# EAGLE design nevjegykartya2019 (EAGLE 9.4.2)
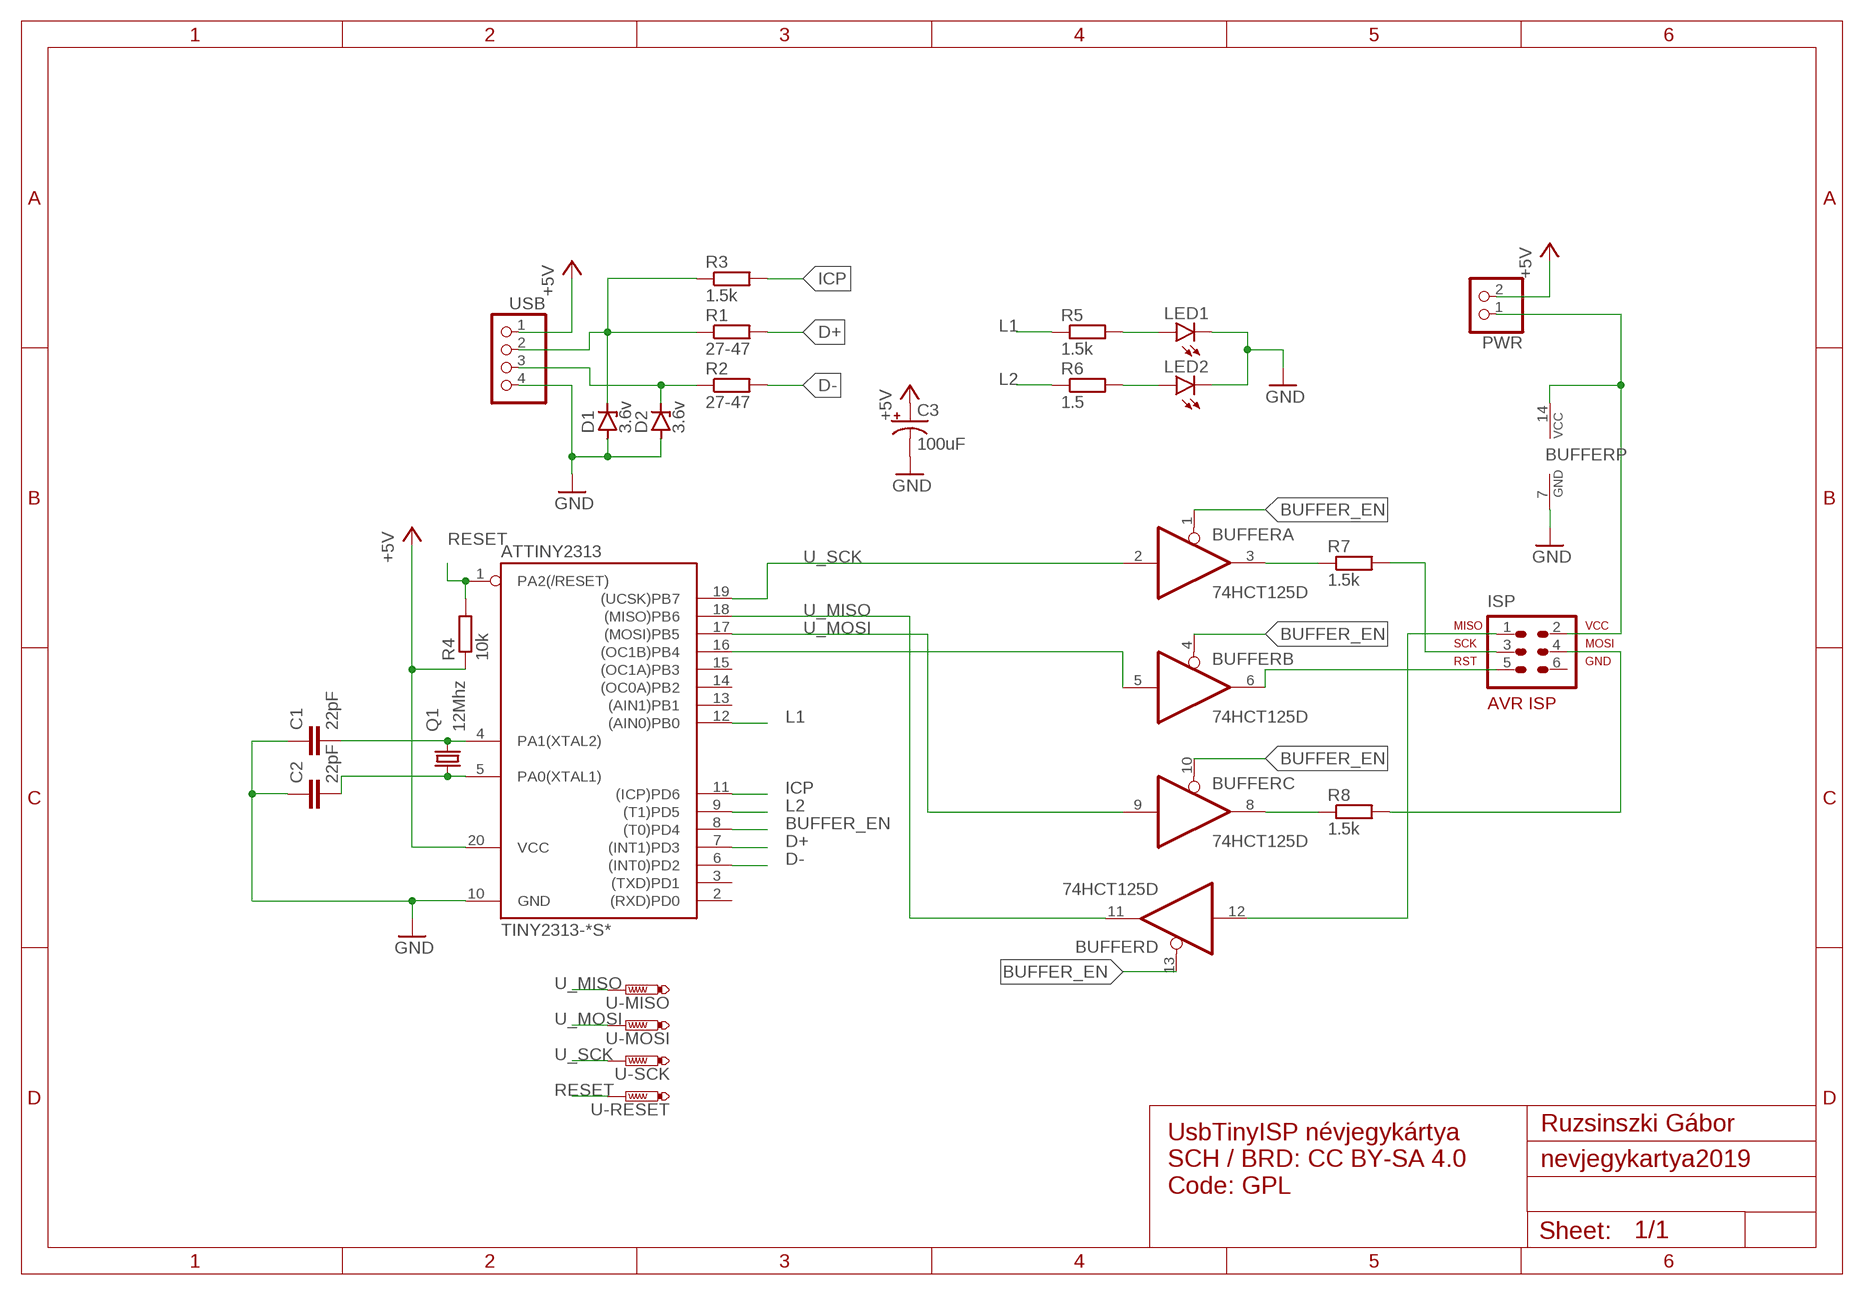
[diagram p0: schematic, sheet 1]

## Parts
ATTINY2313  TINY2313-*S*  [SO20L$]
BUFFER  74HCT125D  [SO14]
C1  22pF  C-EUC1206  [C1206]
C2  22pF  C-EUC1206  [C1206]
C3  100uF  CPOL-USE2.5-5  [E2,5-5]
D1  3.6v  ZENER-DIODESOT223  [SOT223]
D2  3.6v  ZENER-DIODESOT223  [SOT223]
ISP  AVR-ISP-6VERT  [AVR-ISP-6]
LED1  LEDCHIPLED_1206  [CHIPLED_1206]
LED2  LEDCHIPLED_1206  [CHIPLED_1206]
PWR  PINHD-1X2/90  [1X02/90]
Q1  12Mhz  KX-12B  [6.0X3.5_2]
R1  27-47  R-EU_M1206  [M1206]
R2  27-47  R-EU_M1206  [M1206]
R3  1.5k  R-EU_M1206  [M1206]
R4  10k  R-EU_M1206  [M1206]
R5  1.5k  R-EU_M1206  [M1206]
R6  1.5  R-EU_M1206  [M1206]
R7  1.5k  R-EU_M1206  [M1206]
R8  1.5k  R-EU_M1206  [M1206]
U-MISO  PTR1TP20SQ  [TP20SQ]
U-MOSI  PTR1TP20SQ  [TP20SQ]
U-RESET  PTR1TP20SQ  [TP20SQ]
U-SCK  PTR1TP20SQ  [TP20SQ]
USB  PINHD-1X4/90  [1X04/90]

## Nets
+5V: ATTINY2313.20(VCC) C3.+ PWR.2 R4.1 USB.1
BUFFER_EN: ATTINY2313.8((T0)PD4) BUFFER.1(A:OE) BUFFER.4(B:OE) BUFFER.10(C:OE) BUFFER.13(D:OE)
D+: ATTINY2313.7((INT1)PD3) R1.2
D-: ATTINY2313.6((INT0)PD2) R2.2
GND: ATTINY2313.10(GND) BUFFER.7(P:GND) C1.1 C2.1 C3.- D1.1(A) D2.1(A) LED1.C LED2.C USB.4
ICP: ATTINY2313.11((ICP)PD6) R3.2
L1: ATTINY2313.12((AIN0)PB0) R5.1
L2: ATTINY2313.9((T1)PD5) R6.1
MISO: BUFFER.12(D:I) ISP.1
MOSI: ISP.4 R8.2
N$1: LED2.A R6.2
N$2: D1.4(C) R1.1 R3.1 USB.2
N$3: D2.4(C) R2.1 USB.3
N$5: LED1.A R5.2
N$6: BUFFER.8(C:O) R8.1
N$7: BUFFER.3(A:O) R7.1
N$13: ATTINY2313.16((OC1B)PB4) BUFFER.5(B:I)
N$16: ATTINY2313.4(PA1(XTAL2)) C1.2 Q1.2
N$17: BUFFER.14(P:VCC) ISP.2 PWR.1
N$18: ATTINY2313.5(PA0(XTAL1)) C2.2 Q1.1
RESET: ATTINY2313.1(PA2(/RESET)) R4.2 U-RESET.TP
RST: BUFFER.6(B:O) ISP.5
SCK: ISP.3 R7.2
U_MISO: ATTINY2313.18((MISO)PB6) BUFFER.11(D:O) U-MISO.TP
U_MOSI: ATTINY2313.17((MOSI)PB5) BUFFER.9(C:I) U-MOSI.TP
U_SCK: ATTINY2313.19((UCSK)PB7) BUFFER.2(A:I) U-SCK.TP
Unconnected: ATTINY2313.2((RXD)PD0) ATTINY2313.3((TXD)PD1) ATTINY2313.13((AIN1)PB1) ATTINY2313.14((OC0A)PB2) ATTINY2313.15((OC1A)PB3) ISP.6

## Notes on the sheet
- Ruzsinszki Gábor
- UsbTinyISP névjegykártya
  SCH / BRD: CC BY-SA 4.0
  Code: GPL

## Library data of the parts
ATTINY2313 = avr:TINY2313*: Atmel Tiny2313 2K Flash, 128 bytes EEPROM, 128 bytes RAM
BUFFER = 74xx-eu:74*125: Quad bus BUFFER, 3-state
C1 C2 = rcl:C-EU: CAPACITOR, European symbol; SPICEPREFIX: C
C3 = rcl-ez:CPOL-US: POLARIZED CAPACITOR, American symbol
D1 D2 = diode:ZENER-DIODE: Z-Diode
ISP = avr:AVR-ISP-6: AVR ISP-6 Serial Programming Header
LED1 LED2 = led:LED: LED OSRAM: - CHIPLED LG R971, LG N971, LY N971, LG Q971, LY Q971, LO R971, LY R971 LH N974, LH R974 LS Q976, LO Q976, LY Q976 LO Q996 - Hyper CHIPLED LW Q18S LB Q993, LB Q99A, LB R99A - SideLED LS A670, LO A670, LY A670, LG A670, LP A670 LB A673, LV A673, LT A673, LW A673 LH A674 LY A675 LS A676, LA A676, LO A676, LY A676, LW A676 LS A679, LY A679, LG A679 - Hyper Micro SIDELED® LS Y876, LA Y876, LO Y876, LY Y876 LT Y87S - SmartLED LW L88C, LW L88S LB L89C, LB L89S, LG L890 LS L89K, LO L89K, LY L89K LS L896, LA L896, LO L896, LY L896 - TOPLED LS T670, LO T670, LY T670, LG T670, LP T670 LSG T670, LSP T670, LSY T670, LOP T670, LYG T670 LG T671, LOG T671, LSG T671 LB T673, LV T673, LT T673, LW T673 LH T674 LS T676, LA T676, LO T676, LY T676, LB T676, LH T676, LSB T676, LW T676 LB T67C, LV T67C, LT T67C, LS T67K, LO T67K, LY T67K, LW E67C LS E67B, LA E67B, LO E67B, LY E67B, LB E67C, LV E67C, LT E67C LW T67C LS T679, LY T679, LG T679 LS T770, LO T770, LY T770, LG T770, LP T770 LB T773, LV T773, LT T773, LW T773 LH T774 LS E675, LA E675, LY E675, LS T675 LS T776, LA T776, LO T776, LY T776, LB T776 LHGB T686 LT T68C, LB T68C - Hyper Mini TOPLED® LB M676 - Mini TOPLED Santana® LG M470 LS M47K, LO M47K, LY M47K Source: http://www.osram.convergy.de LUXEON: - LUMILED® LXK2-PW12-R00, LXK2-PW12-S00, LXK2-PW14-U00, LXK2-PW14-V00 LXK2-PM12-R00, LXK2-PM12-S00, LXK2-PM14-U00 LXK2-PE12-Q00, LXK2-PE12-R00, LXK2-PE12-S00, LXK2-PE14-T00, LXK2-PE14-U00 LXK2-PB12-K00, LXK2-PB12-L00, LXK2-PB12-M00, LXK2-PB14-N00, LXK2-PB14-P00, LXK2-PB14-Q00 LXK2-PR12-L00, LXK2-PR12-M00, LXK2-PR14-Q00, LXK2-PR14-R00 LXK2-PD12-Q00, LXK2-PD12-R00, LXK2-PD12-S00 LXK2-PH12-R00, LXK2-PH12-S00 LXK2-PL12-P00, LXK2-PL12-Q00, LXK2-PL12-R00 Source: www.luxeon.com KINGBRIGHT: KA-3528ASYC Source: www.kingbright.com
PWR = pinhead:PINHD-1X2: PIN HEADER
Q1 = crystal-geyer_V1_0:KX: Quartz Crystals (MHz) SMD: KX - Serie Model Size l/w/h [mm] Frequency Range Frequency Stability Temp. Range [°C] Load Capacitance AECQ 200 availabel Datasheet KX-4 KX-5 KX-6 KX-7 KX-9A KX-9B KX-12A KX-12B KX-13 KX-20 KX-K KX-KS 1.6/1.2/0.3 2.0/1.6/0.45 2.5/2.0/0.55 3.2/2.5/0.8 5.0/3.2/1.0 5.0/3.2/1.1 6.0/3.5/1.1 6.0/3.5/1.0 7.0/5.0 /1.3 11.6/5.5/1.6 12.3/4.5/4.2 12.3/4.5/3.2 24.0 ~ 80.0 MHz 16.0 ~ 80.0 MHz 12.0 ~ 80.0 MHz 8.0 ~ 60.0 MHz 7,68 ~ 300,0 MHz 8,0 ~ 50,0 MHz 8,0 ~ 150,0 MHz 8,0 ~ 50,0 MHz 6,0 ~ 160,0 MHz 3,579 ~ 25,0 MHz 3,579 ~ 70,0 MHz 3,579 ~ 70,0 MHz ±10 … ±50ppm ±10 … ±50ppm ±10 … ±50ppm ±10 … ±50ppm ±10 … ±50ppm ±10 … ±50ppm ±10 … ±50ppm ±10 … ±50ppm ±10 … ±50ppm ±50ppm ±10 … ±50ppm ±10 … ±50ppm (*) -40°C …+85°C (*) -40°C …+125°C (*) -40°C …+125°C (*) -40°C …+125°C (*) -40°C …+105°C (*) -40°C …+105°C (*) -40°C …+125°C (*) -40°C …+105°C (*) -40°C …+105°C (*) -40°C …+105°C (*) -40°C …+85°C (*) -40°C …+85°C 8, 8…16 8, 8…16 10, 8…16 12, 7…20 16, 10…20 16, 10…20 16, 10…20 16, 12…20 16, 12…20 16, 12…20 16, 12…30 16, 12…30 - yes yes yes - - - - - - - - KX-4.pdf <http://www.geyer-electronic.de/uploads/tx_userartikelfrequenz/GEYER-KX-4.pdf> KX-5.pdf <http://www.geyer-electronic.de/uploads/tx_userartikelfrequenz/GEYER-KX-5.pdf> KX-6.pdf <http://www.geyer-electronic.de/uploads/tx_userartikelfrequenz/GEYER-KX-6.pdf> KX-7.pdf <http://www.geyer-electronic.de/uploads/tx_userartikelfrequenz/GEYER-KX-7.pdf> KX-9A.pdf <http://www.geyer-electronic.de/uploads/tx_userartikelfrequenz/GEYER-KX-9A.pdf> KX-9B.pdf <http://www.geyer-electronic.de/uploads/tx_userartikelfrequenz/GEYER-KX-9B.pdf> KX-12A.pdf <http://www.geyer-electronic.de/uploads/tx_userartikelfrequenz/GEYER-KX-12A.pdf> KX-12B.pdf <http://www.geyer-electronic.de/uploads/tx_userartikelfrequenz/GEYER-KX-12B.pdf> KX-13.pdf <http://www.geyer-electronic.de/uploads/tx_userartikelfrequenz/GEYER-KX-13.pdf> KX-20.pdf <http://www.geyer-electronic.de/uploads/tx_userartikelfrequenz/GEYER-KX-20.pdf> KX-K.pdf <http://www.geyer-electronic.de/uploads/tx_userartikelfrequenz/GEYER-KX-K.pdf> KX-KS.pdf <http://www.geyer-electronic.de/uploads/tx_userartikelfrequenz/GEYER-KX-KS.pdf> <http://www.geyer-electronic.de/fileadmin/template/img/logo-geyer-electronic.png> Details see: http://www.geyer-electronic.de/Frequenz-Produkte.9.0.html Created 2016-06-07, Hans Locher 2016 (C) Geyer Quartz Technology KX4,KX5,KX6,KX7,KX9A,KX9B,KX12A,KX12B,KX13,KX20,KXK,KXKS;1612;2016;2520;3225;5032;6035;7050;11655;12345;1,6x1,2;2,0x1,6;2,5x2,0;3,2x2,5;5,0x3,2;6,0x3,5;7,0x5,0;11,6x5,5;12,3x4,5;12,3x4,5;1.6x1.2;2.0x1.6;2.5x2.0;3.2x2.5;5.0x3.2;6.0x3.5;7.0x5.0;11.6x5.5;12.3x4.5;12.3x4.5;
R1-R8 = rcl:R-EU_: RESISTOR, European symbol; SPICEPREFIX: R
U-MISO U-MOSI U-RESET U-SCK = testpad:PTR1: TEST PIN
USB = pinhead:PINHD-1X4: PIN HEADER

## Board
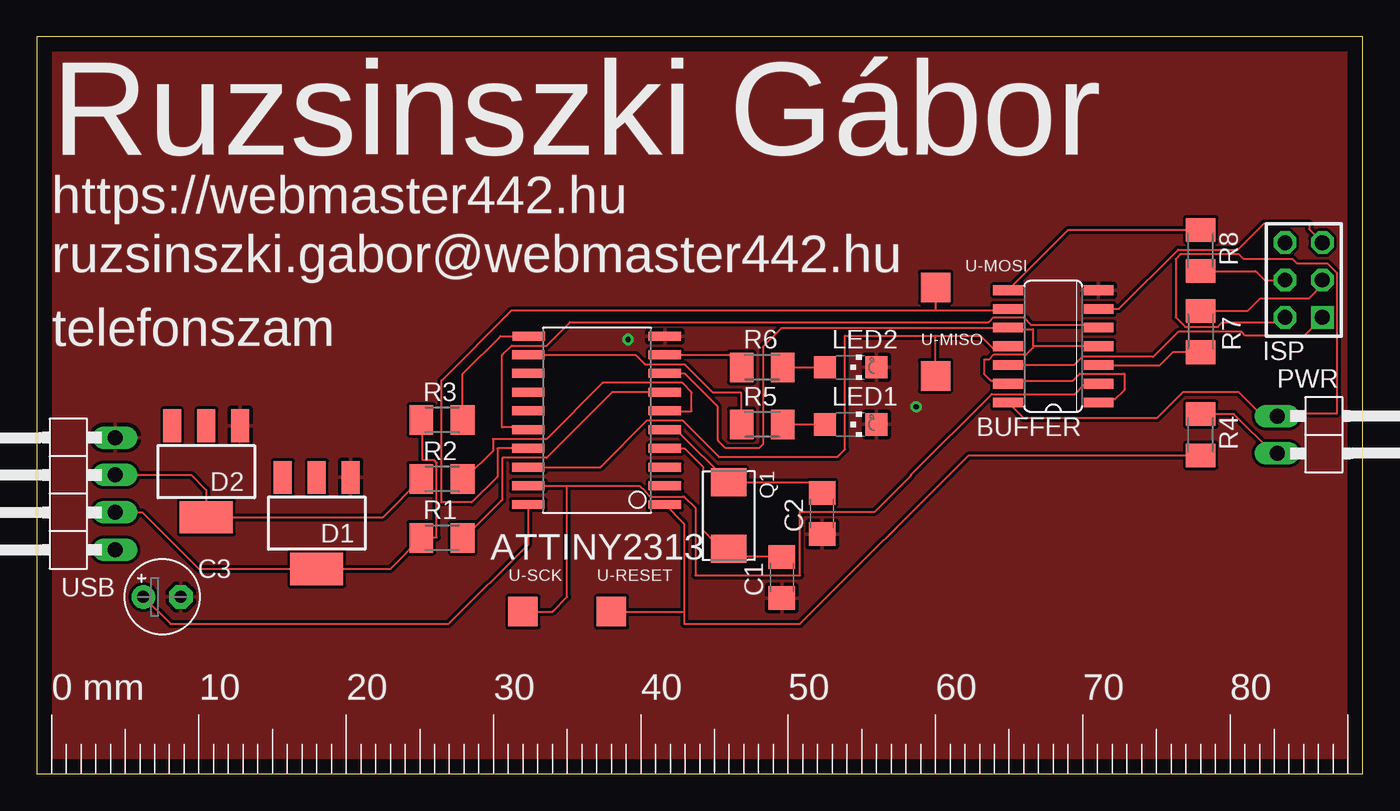
[diagram p1: board, top side]
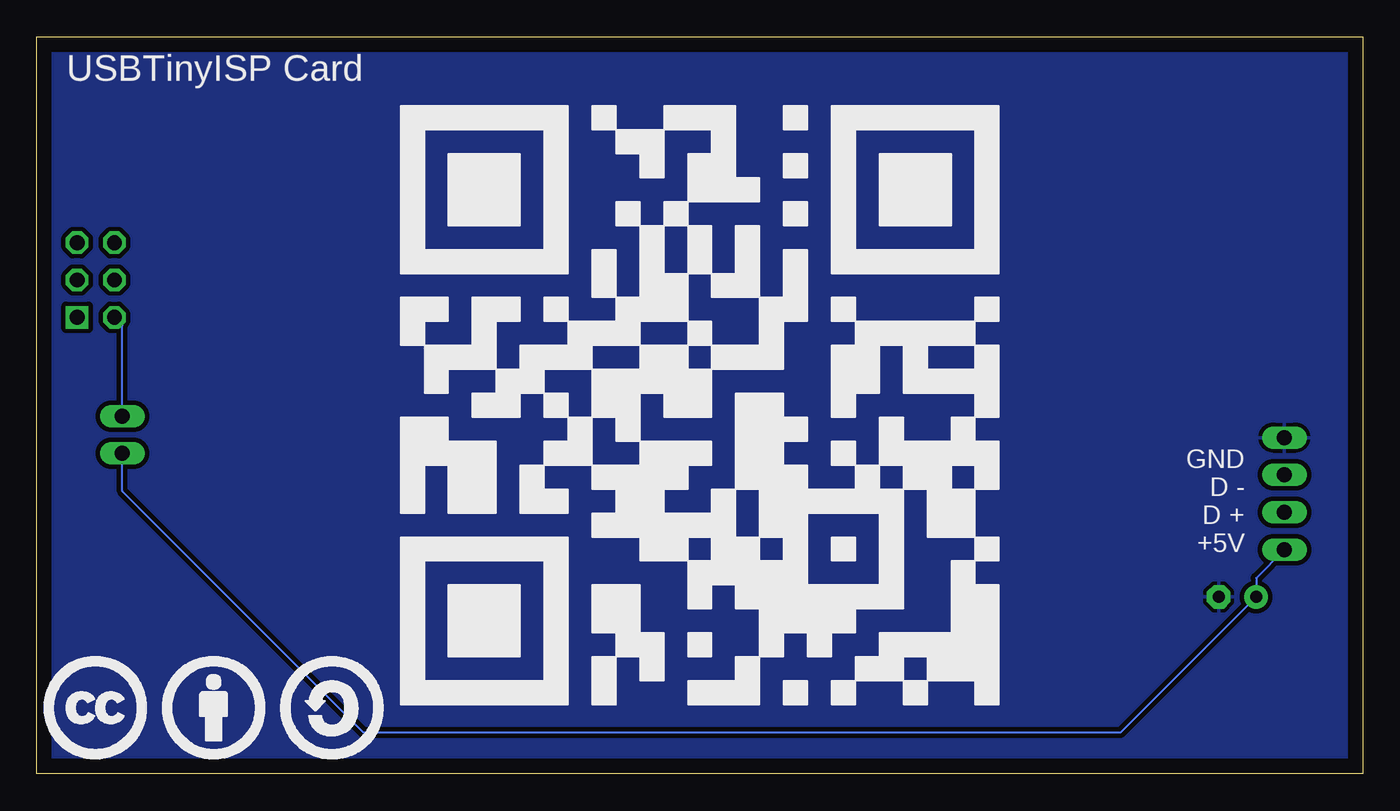
[diagram p2: board, bottom side, seen from below]

Size 90 x 50 mm. Coordinates in mm from the lower left corner, seen from the top.
Outline: 0,0 90,0 90,50 0,50 0,0
Copper layers (1*16): Top 0.035mm / dielectric 1.5mm / Bottom 0.035mm
Design rules "default": minimum track width 6mil, minimum drill 0.35mm, track to track 6mil, track to pad 6mil, pad to pad 6mil, via to via 6mil, smd to smd 6mil, copper to edge 40mil, drill to drill 6mil, minimum pad ring 10mil, minimum via ring 8mil, stop-mask expansion 4mil, vias tented up to drill 0mil, thermal gap 10mil
tKeepout: area 62.5,7.7 to 88.3,18.8; area 62.5,7.7 to 88.3,18.8
bKeepout: area 26.3,33.9 to 27.9,35.6; area 24.7,38.8 to 26.3,40.4; area 26.3,20.9 to 27.9,22.6; area 45.8,30.7 to 47.4,32.3; area 34.4,27.4 to 36.1,29.1; area 58.8,7.9 to 60.4,9.6; area 29.6,7.9 to 31.2,9.6; area 50.7,6.3 to 52.3,7.9; area 47.4,42.1 to 49.1,43.7; area 27.9,6.3 to 29.6,7.9; area 47.4,19.3 to 49.1,20.9; area 45.8,32.3 to 47.4,33.9; 636 more areas

### Footprints (pad centres in the part's own frame; a part is rotated, then mirrored left to right if it is on the bottom)
SO20L$ = smd 0.61 x 2.21: 1 -5.715,-4.636; 2 -4.445,-4.636; 3 -3.175,-4.636; 4 -1.905,-4.636; 5 -0.635,-4.636; 6 0.635,-4.636; 7 1.905,-4.636; 8 3.175,-4.636; 9 4.445,-4.636; 10 5.715,-4.636; 11 5.715,4.61; 12 4.445,4.636; 13 3.175,4.636; 14 1.905,4.636; 15 0.635,4.636; 16 -0.635,4.636; 17 -1.905,4.636; 18 -3.175,4.636; 19 -4.445,4.636; 20 -5.715,4.636
SO14 = smd 0.66 x 2.032: 1 -3.81,-3.073; 2 -2.54,-3.073; 3 -1.27,-3.073; 4 0,-3.073; 5 1.27,-3.073; 6 2.54,-3.073; 7 3.81,-3.073; 8 3.81,3.073; 9 2.54,3.073; 10 1.27,3.073; 11 0,3.073; 12 -1.27,3.073; 13 -2.54,3.073; 14 -3.81,3.073
C1206 = smd 1.6 x 1.8: 1 -1.4,0; 2 1.4,0
E2,5-5 = drill 0.813 pad 1.6: + -1.27,0 | drill 0.813 pad 1.6 octagon: - 1.27,0
SOT223 = smd 1.219 x 2.235: 1 -2.311,-3.099; 2 0,-3.099; 3 2.311,-3.099 | smd 3.6 x 2.2: 4 0,3.099
AVR-ISP-6 = drill 1.016 square: 1 -2.54,-1.27 | drill 1.016 octagon: 2 -2.54,1.27; 3 0,-1.27; 4 0,1.27; 5 2.54,-1.27; 6 2.54,1.27
CHIPLED_1206 = smd 1.5 x 1.5: A 0,-1.75; C 0,1.75
1X02/90 = drill 1.016 long: 1 -1.27,-3.81; 2 1.27,-3.81
6.0X3.5_2 = smd 1.9 x 2.4: 1 -2.25,0; 2 2.25,0
M1206 = smd 1.6 x 2: 1 -1.4,0; 2 1.4,0
TP20SQ = smd 2 x 2: TP 0,0
1X04/90 = drill 1.016 long: 1 -3.81,-3.81; 2 -1.27,-3.81; 3 1.27,-3.81; 4 3.81,-3.81

### Placement (x,y rotation side)
ATTINY2313  38,23.98 90 top
BUFFER  69,29 90 top
C1  50.58,13.31 90 top
C2  53.3,17.65 90 top
C3  8.5,12 0 top
D1  19,17 180 top
D2  11.5,20.5 180 top
ISP  86,33.5 90 top
LED1  55.25,23.7 270 top
LED2  55.25,27.57 270 top
PWR  88,23 270 top
Q1  46.97,17.52 270 top
R1  27.5,16 0 top
R2  27.5,20 0 top
R3  27.5,24 0 top
R4  79,23 270 top
R5  49.25,23.7 0 top
R6  49.25,27.57 0 top
R7  79,30 90 top
R8  79,35.5 270 top
U-MISO  61,27 0 top
U-MOSI  61,33 0 top
U-RESET  39,11 0 top
U-SCK  33,11 0 top
USB  1.5,19 90 top

### Tracks (layer width: path | path; a pad name or v marks a point on that pad's centre or on a via)
+5V
  Top 0.152: PWR.2 83.93,21.73 81.26,24.4 R4.1 | C3.+ 9.07,10.16 27.94,10.16 33.36,15.59 ATTINY2313.20
  Bottom 0.152: USB.1 7.23,13.27 C3.+ 16.44,2.79 67.82,2.79 84.19,19.17 PWR.2
BUFFER_EN
  Top 0.152: 65.72,26.67 65.88,26.51 BUFFER.13 65.72,26.67 | 65.72,26.67 64.77,26.67 64.29,27.15 64.29,28.1 64.61,28.1 64.93,28.42 67.15,28.42 67.63,28.89 67.63,29.05 | 67.63,29.05 67.63,30.16 66.04,30.16 BUFFER.10 65.88,30.23 50.55,30.23 49.28,28.96 49.28,22.35 49.02,22.1 46.74,22.1 46.23,22.61 46.23,24.89 43.96,27.16 ATTINY2313.8 42.7,27.15 | 65.72,26.67 70.33,26.67 70.8,27.15 73.82,27.15 73.82,26.04 73.18,25.4 72.39,25.4 72.23,25.24 BUFFER.1 | 67.63,29.05 72.07,29.05 BUFFER.4
D+
  Top 0.152: R1.2 29.05,16.03 31.59,18.57 31.59,21.43 34.61,21.43 39.05,25.88 42.55,25.88 ATTINY2313.7
D-
  Top 0.152: R2.2 29.05,20 30.96,21.91 30.96,22.7 34.61,22.7 38.42,26.51 43.81,26.51 44.45,25.88 44.45,24.61 42.7,24.61 ATTINY2313.6
GND  (via drill 0.35)
  other vias: 59.69,24.89 40.13,29.46
  pour Bottom (isolate 0.305, rank 3): 0,50 90,50 90,0 0,0
  pour Top (isolate 0.2, rank 3): 0,50 90,50 90,0 0,0
ICP
  Top 0.152: R3.2 28.9,27.12 31.47,29.7 ATTINY2313.11
L1
  Top 0.152: R5.1 47.78,23.81 47.78,25.88 45.88,25.88 43.97,27.78 41.27,27.78 40.64,28.42 33.5,28.42 ATTINY2313.12
L2
  Top 0.152: R6.1 47.78,27.62 46.99,28.42 42.7,28.42 ATTINY2313.9
MISO
  Top 0.152: ISP.1 86.03,29.72 82.04,29.72 81.79,29.97 77.47,29.97 75.79,28.29 70.96,28.29 70.4,27.73 BUFFER.12
MOSI
  Top 0.152: R8.2 82.74,34.1 83.34,33.5 ISP.4
N$1
  Top 0.152: R6.2 LED2.A
N$2
  Top 0.152: USB.2 7.16,17.73 10.99,13.9 D1.4 24,13.9 R1.1 26.19,16.03 27.15,16.03 27.15,21.11 26.99,21.27 26.19,21.27 26.19,23.97 R3.1
N$3
  Top 0.152: USB.3 10.46,20.27 11.5,19.23 D2.4 23.5,17.4 R2.1
N$5
  Top 0.152: R5.2 LED1.A
N$6
  Top 0.152: BUFFER.8 70.02,36.9 R8.1
N$7
  Top 0.152: R7.1 77.11,28.6 76.2,27.69 72.12,27.69 BUFFER.3
N$13
  Top 0.152: BUFFER.5 72.07,30.32 71.91,30.48 67.47,30.48 66.99,30.96 64.93,30.96 64.61,30.64 36.2,30.64 34.61,29.05 32.23,29.05 31.59,28.42 31.59,23.5 33.34,23.5 ATTINY2313.16
N$16
  Top 0.152: 42.7,22.07 ATTINY2313.4 43.96,22.08 45.21,20.83 45.21,16.51 46.48,15.24 46.94,15.24 Q1.2 47.52,14.71 C1.2
N$17
  Top 0.152: 83.03,24.45 83.19,24.29 84.14,24.29 PWR.1 83.03,24.45 | 83.03,24.45 81.6,25.88 77.79,25.88 76.04,24.13 66.99,24.13 66.04,25.08 BUFFER.14 | 83.03,24.45 88.27,24.45 88.27,33.97 87.63,34.61 85.57,34.61 85.25,34.92 81.92,34.92 81.6,35.24 77.63,35.24 77.31,34.92 77.31,30.96 77.95,30.32 80.17,30.32 80.49,30.64 84.3,30.64 84.61,30.96 ISP.2
  Bottom 0.152: PWR.1 84.19,30.42 ISP.2
N$18
  Top 0.152: 47.02,19.75 Q1.1 | 42.7,23.34 ATTINY2313.5 | ATTINY2313.5 43.42,23.35 | Q1.1 52.58,19.77 C2.2 | ATTINY2313.5 43.39,23.35 Q1.1
RESET
  Top 0.152: 42.7,18.26 ATTINY2313.1 43.94,16.96 43.94,11 | R4.2 63.26,21.6 51.82,10.16 43.94,10.16 43.94,11 | U-RESET.TP 43.94,11
RST
  Top 0.152: BUFFER.6 73.45,31.54 77.47,35.56 81.53,35.56 83.31,37.34 86.36,37.34 86.36,36.95 ISP.5
SCK
  Top 0.152: R7.2 82.2,31.4 83.06,32.26 86.36,32.26 87.27,33.17 ISP.3
U_MISO
  Top 0.152: BUFFER.11 65.88,28.89 64.86,28.89 64.04,29.72 61,29.72 | ATTINY2313.18 33.5,20.8 38.26,20.8 41.43,23.97 43.81,23.97 46.29,21.5 54.36,21.5 54.86,22 54.86,29.72 61,29.72 | U-MISO.TP 61,29.72
U_MOSI
  Top 0.152: 61,31.43 32.23,31.43 27.46,26.67 27.46,18.41 29.53,18.41 31.27,20.16 31.27,22.07 33.34,22.07 ATTINY2313.17 | 61,31.43 65.88,31.43 BUFFER.9 | U-MOSI.TP 61,31.43
U_SCK
  Top 0.152: BUFFER.2 72.07,26.35 71.06,26.35 70.45,25.75 64.82,25.75 59.35,20.28 59.35,20.23 56.9,17.78 51.82,17.78 51.82,13.46 44.7,13.46 44.7,18.03 43.94,18.8 43.84,18.8 41.64,18.8 41.3,19.14 41.3,19.15 40.92,19.54 36,19.54 | 33.5,19.53 ATTINY2313.19 36,19.54 | U-SCK.TP 35,11 36,12 36,19.54

### Text on the board
tNames: Ruzsinszki Gábor | https://webmaster442.hu | ruzsinszki.gabor@webmaster442.hu | telefonszam | 0 mm | 10 | 20 | 30 | 40 | 50 | 60 | 70 | 80
bNames: USBTinyISP Card | GND / D - / D + / +5V